# EAGLE design Outline (EAGLE 6.2)
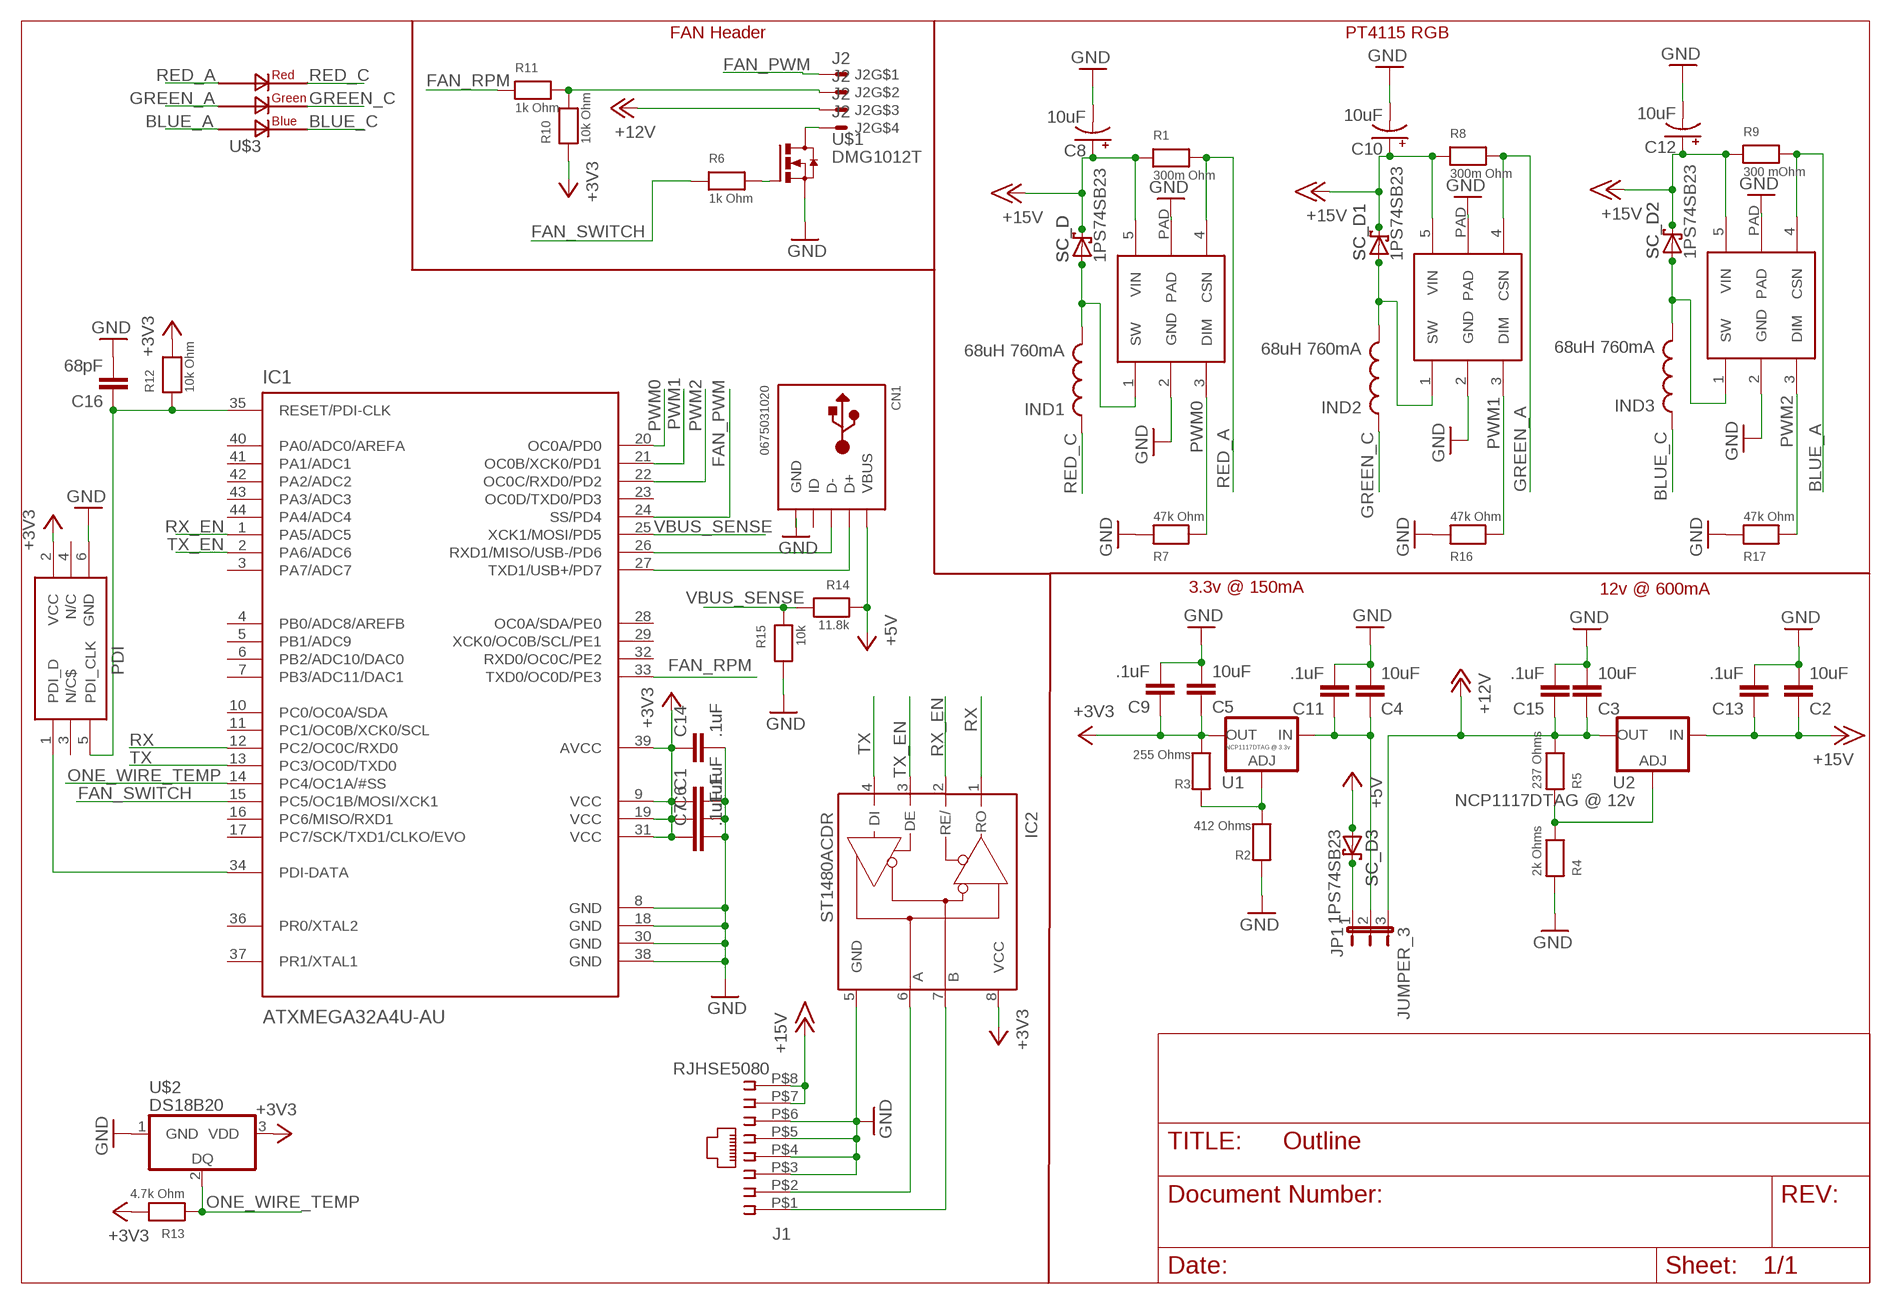
[diagram p0: schematic, sheet 1]

## Parts
C1  .1uF  CAP0603-CAP  [0603-CAP]
C2  10uF  CAP1210  [1210]
C3  10uF  CAP1210  [1210]
C4  10uF  CAP1210  [1210]
C5  10uF  CAP1210  [1210]
C6  .1uF  CAP0603-CAP  [0603-CAP]
C7  .1uF  CAP0603-CAP  [0603-CAP]
C8  10uF  CAP_POLC  [PANASONIC_C]
C9  .1uF  CAP0603-CAP  [0603-CAP]
C10  10uF  CAP_POLC  [PANASONIC_C]
C11  .1uF  CAP0603-CAP  [0603-CAP]
C12  10uF  CAP_POLC  [PANASONIC_C]
C13  .1uF  CAP0603-CAP  [0603-CAP]
C14  .1uF  CAP0603-CAP  [0603-CAP]
C15  .1uF  CAP0603-CAP  [0603-CAP]
C16  68pF  CAP0603-CAP  [0603-CAP]
CN1  0675031020  USB_MINI_B  [MOLEX_675031020]
DRV0  PT4115  [SOT89-5]
DRV1  PT4115  [SOT89-5]
DRV2  PT4115  [SOT89-5]
IC1  ATXMEGA32A4U-AU  ATXMEGAXXA4U-AU  [TQFP-44]
IC2  ST1480ACDR  MAX3468CSA  [SO08]
IND1  68uH 760mA  INDUCTOR  [CR54]
IND2  68uH 760mA  INDUCTOR  [CR54]
IND3  68uH 760mA  INDUCTOR  [CR54]
J1  RJHSE5080  AMP_RJ45  [RJHSE5080]
J2  J2  470531000  [47053-1000]
JP1  JUMPER_3  [JP2E]
PDI  AVR_PDI  [AVR_PDI]
R1  300m Ohm  RESISTOR0805  [0805]
R2  412 Ohms  RESISTOR0603  [0603]
R3  255 Ohms  RESISTOR0603  [0603]
R4  2k Ohms  RESISTOR0603  [0603]
R5  237 Ohms  RESISTOR0603  [0603]
R6  1k Ohm  RESISTOR0603  [0603]
R7  47k Ohm  RESISTOR0603  [0603]
R8  300m Ohm  RESISTOR0805  [0805]
R9  300 mOhm  RESISTOR0805  [0805]
R10  10k Ohm  RESISTOR0603  [0603]
R11  1k Ohm  RESISTOR0603  [0603]
R12  10k Ohm  RESISTOR0603  [0603]
R13  4.7k Ohm  RESISTOR0603  [0603]
R14  11.8k  RESISTOR0603  [0603]
R15  10k  RESISTOR0603  [0603]
R16  47k Ohm  RESISTOR0603  [0603]
R17  47k Ohm  RESISTOR0603  [0603]
SC_D  1PS74SB23  SCHOTTYKY  [SOT-457]
SC_D1  1PS74SB23  SCHOTTYKY  [SOT-457]
SC_D2  1PS74SB23  SCHOTTYKY  [SOT-457]
SC_D3  1PS74SB23  SCHOTTKY_2  [NSR05F20]
U1  NCP1117DTAG @ 3.3v  V_REG_317DPACK  [V-REG_DPACK]
U2  NCP1117DTAG @ 12v  V_REG_317DPACK  [V-REG_DPACK]
U$1  DMG1012T  [DMG1012T]
U$2  DS18B20  [TOP-92-INLINE]
U$3  10W_RGB_LED  [10W_LED]

## Nets
+3V3: C1.1 C5.1 C6.1 C7.1 C9.1 C14.1 IC1.9(VCC) IC1.19(VCC) IC1.31(VCC) IC1.39(AVCC) IC2.8(VCC) PDI.2(VCC) R3.2 R10.1 R12.2 R13.2 U1.4(OUT) U$2.3(VDD)
+5V: CN1.P$1(VBUS) R14.1 SC_D3.P$2(A)
+12V: C3.1 C15.1 J2.3 JP1.3 R5.2 U2.4(OUT)
+15V: C2.1 C8.+ C10.+ C12.+ C13.1 DRV0.5(VIN) DRV1.5(VIN) DRV2.5(VIN) J1.P$7 J1.P$8 R1.1 R8.1 R9.1 SC_D1.P$2(C) SC_D1.P$5(C) SC_D2.P$2(C) SC_D2.P$5(C) SC_D.P$2(C) SC_D.P$5(C) U2.3(IN)
BLUE_A: DRV2.4(CSN) R9.2 U$3.B$A
BLUE_C: IND3.P$1 U$3.B$C
FAN_PWM: IC1.24(SS/PD4) J2.1
FAN_RPM: IC1.33(TXD0/OC0D/PE3) R11.1
FAN_SWITCH: IC1.15(PC5/OC1B/MOSI/XCK1) R6.1
GND: C1.2 C2.2 C3.2 C4.2 C5.2 C6.2 C7.2 C8.- C9.2 C10.- C11.2 C12.- C13.2 C14.2 C15.2 C16.2 CN1.P$5(GND) DRV0.2(GND) DRV0.PAD DRV1.2(GND) DRV1.PAD DRV2.2(GND) DRV2.PAD IC1.8(GND) IC1.18(GND) IC1.30(GND) IC1.38(GND) IC2.5(GND) J1.P$3 J1.P$4 J1.P$5 J1.P$6 PDI.6(GND) R2.1 R4.1 R7.1 R15.2 R16.1 R17.1 U$1.P$S(S) U$2.1(GND)
GREEN_A: DRV1.4(CSN) R8.2 U$3.G$A
GREEN_C: IND2.P$1 U$3.G$C
N$1: R2.2 R3.1 U1.1(ADJ)
N$2: R4.2 R5.1 U2.1(ADJ)
N$3: J2.4 U$1.P$D(D)
N$4: R6.2 U$1.P$G(G)
N$6: JP1.1 SC_D3.P$1(C)
N$9: DRV0.1(SW) IND1.P$2 SC_D.P$1(A) SC_D.P$3(A) SC_D.P$4(A) SC_D.P$6(A)
N$12: DRV1.1(SW) IND2.P$2 SC_D1.P$1(A) SC_D1.P$3(A) SC_D1.P$4(A) SC_D1.P$6(A)
N$15: DRV2.1(SW) IND3.P$2 SC_D2.P$1(A) SC_D2.P$3(A) SC_D2.P$4(A) SC_D2.P$6(A)
N$20: IC1.34(PDI-DATA) PDI.1(PDI_D)
N$21: C4.1 C11.1 JP1.2 U1.3(IN)
N$22: C16.1 IC1.35(RESET/PDI-CLK) PDI.5(PDI_CLK) R12.1
N$25: J2.2 R10.2 R11.2
ONE_WIRE_TEMP: IC1.14(PC4/OC1A/#SS) R13.1 U$2.2(DQ)
PWM0: DRV0.3(DIM) IC1.20(OC0A/PD0) R7.2
PWM1: DRV1.3(DIM) IC1.21(OC0B/XCK0/PD1) R16.2
PWM2: DRV2.3(DIM) IC1.22(OC0C/RXD0/PD2) R17.2
RED_A: DRV0.4(CSN) R1.2 U$3.R$A
RED_C: IND1.P$1 U$3.R$C
RS485_N: IC2.7(B) J1.P$1
RS485_P: IC2.6(A) J1.P$2
RX: IC1.12(PC2/OC0C/RXD0) IC2.1(RO)
RX_EN: IC1.1(PA5/ADC5) IC2.2(RE/)
TX: IC1.13(PC3/OC0D/TXD0) IC2.4(DI)
TX_EN: IC1.2(PA6/ADC6) IC2.3(DE)
USB+: CN1.P$3(D+) IC1.27(TXD1/USB+/PD7)
USB-: CN1.P$2(D-) IC1.26(RXD1/MISO/USB-/PD6)
VBUS_SENSE: IC1.25(XCK1/MOSI/PD5) R14.2 R15.1
Unconnected: CN1.P$4(ID) IC1.3(PA7/ADC7) IC1.4(PB0/ADC8/AREFB) IC1.5(PB1/ADC9) IC1.6(PB2/ADC10/DAC0) IC1.7(PB3/ADC11/DAC1) IC1.10(PC0/OC0A/SDA) IC1.11(PC1/OC0B/XCK0/SCL) IC1.16(PC6/MISO/RXD1) IC1.17(PC7/SCK/TXD1/CLKO/EVO) IC1.23(OC0D/TXD0/PD3) IC1.28(OC0A/SDA/PE0) IC1.29(XCK0/OC0B/SCL/PE1) IC1.32(RXD0/OC0C/PE2) IC1.36(PR0/XTAL2) IC1.37(PR1/XTAL1) IC1.40(PA0/ADC0/AREFA) IC1.41(PA1/ADC1) IC1.42(PA2/ADC2) IC1.43(PA3/ADC3) IC1.44(PA4/ADC4) PDI.3(N/C$) PDI.4(N/C)

## Notes on the sheet
- FAN Header | PT4115 RGB
- 3.3v @ 150mA | 12v @ 600mA

## Power pins joined to a net without a drawn wire
GND: CN1.GND@1(GND) CN1.GND@2(GND) CN1.GND@3(GND) CN1.GND@4(GND)

## Library data of the parts
C1-C7 C9 C11 C13-C16 = SparkFun:CAP: Capacitor Standard 0603 ceramic capacitor, and 0.1" leaded capacitor.
C8 C10 C12 = SparkFun:CAP_POL: Capacitor Polarized These are standard SMD and PTH capacitors. Normally 10uF, 47uF, and 100uF in electrolytic and tantalum varieties. Always verify the external diameter of the through hole cap, it varies with capacity, voltage, and manufacturer. The EIA devices should be standard.
CN1 = TechIsCool:USB_MINI_B
DRV0 DRV1 DRV2 = 1dah:PT4115: Small switching mode constant current PS
IC1 = nonolith:ATXMEGAXXA4U: ATXMEGA A4U Series (XMEGA+USB)
IC2 = maxim:MAX34*: +5V, Fail-Safe, 40Mbps, Profibus RS-485/RS-422 Transceivers Source: MAX3465-MAX3469.pdf; MPN: MAX3468CSA+; OC_FARNELL: unknown; OC_NEWARK: 76K6721
IND1-IND3 = TechIsCool:INDUCTOR
J1 = TechIsCool:AMP_RJ45
J2 = TechIsCool:470531000
JP1 = TechIsCool:JUMPER_3
PDI = TechIsCool:AVR_PDI
R1-R17 = nonolith:RESISTOR: Resistors 0402 - 0402 Surface Mount Package 10.0K 1% 1/16W [Digikey: 311-10.0KLRTR-ND] 0603 - 0603 Surface Mount Package 0 Ohm 1/10 Watt 1% Resistor 15 Ohm 1/10 Watt 1% Resistor 33 Ohm 1/10 Watt 1% Resistor 49.9 Ohm 1/10 Watt 1% Resistor 100 Ohm 1/10 Watt 1% Resistor 150 Ohm 1/10 Watt 1% Resistor 240 Ohm 1/10 Watt 1% Resistor 390 Ohm 1/10 Watt 1% Resistor 560 Ohm 1/10 Watt 1% Resistor 750 Ohm 1/10 Watt 1% Resistor 1.0K Ohm 1/10 Watt 1% Resistor 1.5K Ohm 1/10 Watt 1% Resistor 2.0K Ohm 1/10 Watt 1% Resistor 4.7K Ohm 1/10 Watt 1% Resistor 10.0K Ohm 1/10 Watt 1% Resistor 20.0K Ohm 1/10 Watt 1% Resistor 33.0K Ohm 1/10 Watt 1% Resistor 100.0K Ohm 1/10 Watt 1% Resistor 0805 - 0805 Surface Mount Package 0 Ohm 1/8 Watt 1% Resistor 33 Ohm 1/8 Watt 1% Resistor 100 Ohm 1/8 Watt 1% Resistor 150 Ohm 1/8 Watt 1% Resistor 200 Ohm 1/8 Watt 1% Resistor 240 Ohm 1/8 Watt 1% Resistor 330 Ohm 1/8 Watt 1% Resistor 390 Ohm 1/8 Watt 1% Resistor 470 Ohm 1/8 Watt 1% Resistor 1.0K Ohm 1/8 Watt 1% Resistor 1.5K Ohm 1/8 Watt 1% Resistor 2.0K Ohm 1/8 Watt 1% Resistor 4.7K Ohm 1/8 Watt 1% Resistor 5.1K Ohm 1/8 Watt 1% Resistor 5.6K Ohm 1/8 Watt 1% Resistor 10.0K Ohm 1/8 Watt 1% Resistor 22.0K Ohm 1/8 Watt 1% Resistor 33.0K Ohm 1/8 Watt 1% Resistor 100K Ohm 1/8 Watt 1% Resistor 1206 - 1206 Surface Mount Package
SC_D SC_D1 SC_D2 = TechIsCool:SCHOTTYKY
SC_D3 = TechIsCool:SCHOTTKY_2
U1 U2 = SparkFun:V_REG_317: Voltage Regulator Standard LM317 adjustable voltage regulator. AOI (Adjust Output Input). Google 'LM317 Calculator' for easy to use app to get the two resistor values needed. 240/720 for 5V output. 240/390 for 3.3V output. Spark Fun Electronics SKU : COM-00527
U$1 = TechIsCool:DMG1012T
U$2 = TechIsCool:DS18B20
U$3 = TechIsCool:10W_RGB_LED

## Board
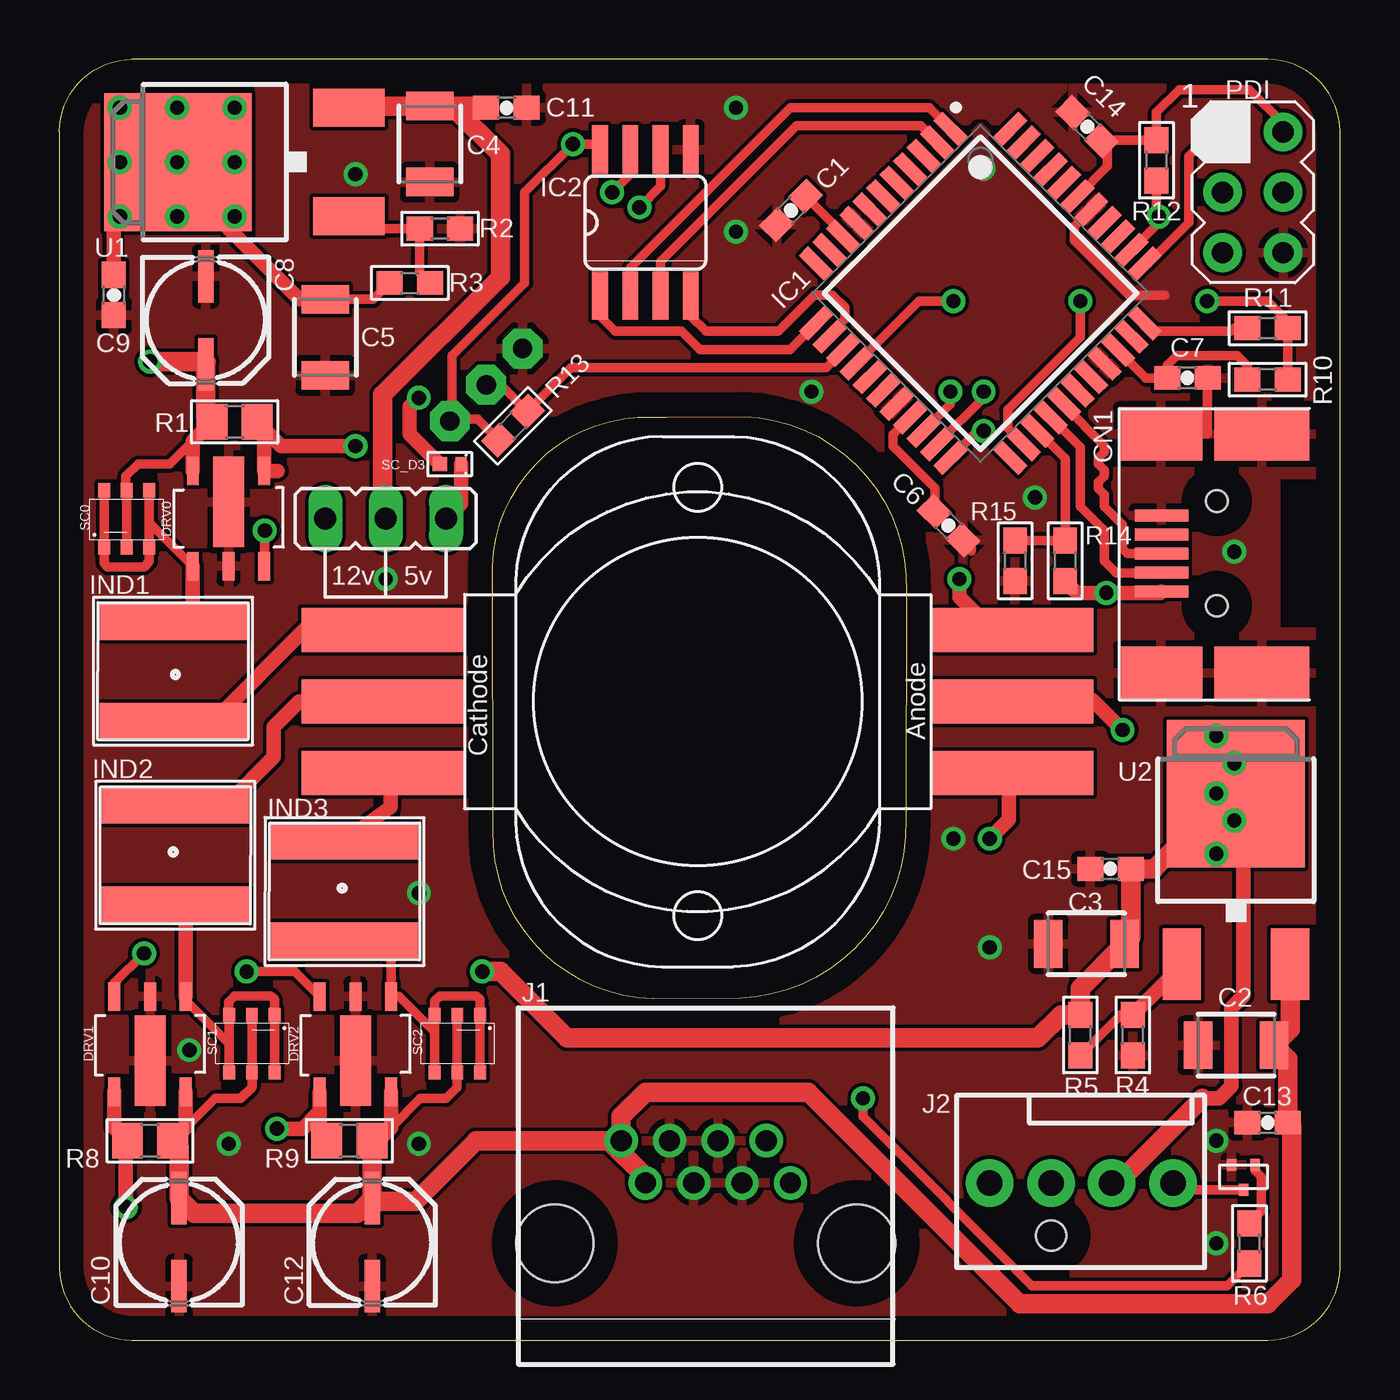
[diagram p1: board, top side]
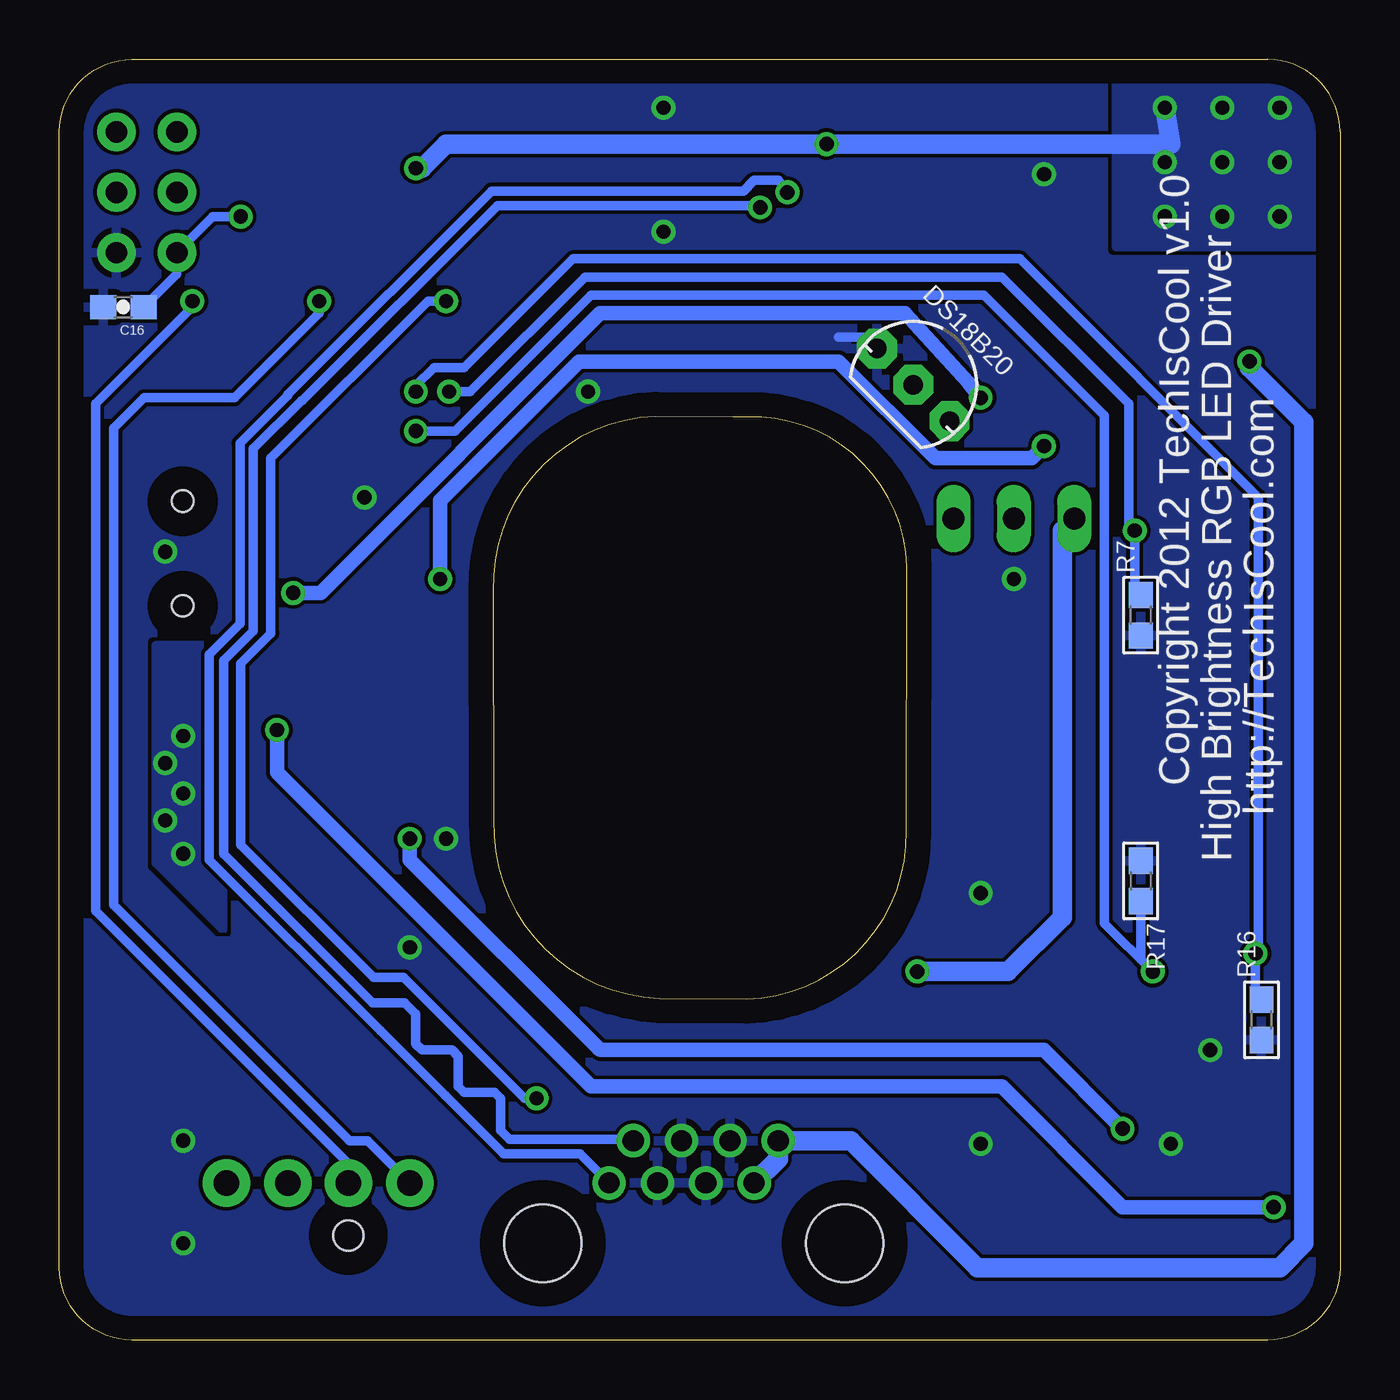
[diagram p2: board, bottom side, seen from below]

Size 53.85 x 53.85 mm. Coordinates in mm from the lower left corner, seen from the top.
Outline: 50.8,0 3.05,0 arc-90 0,3.05 0,50.8 arc-90 3.05,53.85 50.8,53.85 arc-90 53.85,50.8 53.85,3.05
Outline: 50.8,0 arc90 53.85,3.05
Outline: 50.8,0 arc90 53.85,3.05
Copper layers (1*16): Top 0.035mm / dielectric 1.6mm / Bottom 0.035mm
Design rules: minimum track width 6mil, minimum drill 0.3mm, track to track 6mil, track to pad 8mil, pad to pad 8mil, via to via 8mil, smd to smd 8mil, copper to edge 40mil, drill to drill 8mil, minimum pad ring 10mil, minimum via ring 8mil, stop-mask expansion 4mil, vias tented up to drill 0mil, thermal gap 10mil

### Footprints (pad centres in the part's own frame; a part is rotated, then mirrored left to right if it is on the bottom)
0603-CAP = smd 1.1 x 1: 1 -0.85,0; 2 0.85,0
1210 = smd 1.2 x 2: 1 -1.6,0; 2 1.6,0
PANASONIC_C = smd 2.2 x 0.65: + 1.9,-0.2; - -1.8,-0.2
MOLEX_675031020 = smd 4 x 2.25: GND@1 2,4.925; GND@4 2,-5.125 | smd 3.5 x 2.25: GND@2 -2.25,4.925; GND@3 -2.25,-5.125 | smd 2.25 x 0.5: P$1 -2.225,-1.7; P$2 -2.225,-0.9; P$3 -2.225,-0.1; P$4 -2.225,0.7; P$5 -2.225,1.5 | hole 0.9: 0.1,2.1; 0.1,-2.3
SOT89-5 = smd 0.5 x 1.2: 1 -1.5,-2; 2 0,-2; 3 1.5,-2; 4 1.5,2; 5 -1.5,2 | smd 1.3 x 3.8: PAD 0,0.7
TQFP-44 = smd 1.55 x 0.55: 1 -5.75,4; 2 -5.75,3.2; 3 -5.75,2.4; 4 -5.75,1.6; 5 -5.75,0.8; 6 -5.75,0; 7 -5.75,-0.8; 8 -5.75,-1.6; 9 -5.75,-2.4; 10 -5.75,-3.2; 11 -5.75,-4; 23 5.75,-4; 24 5.75,-3.2; 25 5.75,-2.4; 26 5.75,-1.6; 27 5.75,-0.8; 28 5.75,0; 29 5.75,0.8; 30 5.75,1.6; 31 5.75,2.4; 32 5.75,3.2; 33 5.75,4 | smd 0.55 x 1.55: 12 -4,-5.75; 13 -3.2,-5.75; 14 -2.4,-5.75; 15 -1.6,-5.75; 16 -0.8,-5.75; 17 0,-5.75; 18 0.8,-5.75; 19 1.6,-5.75; 20 2.4,-5.75; 21 3.2,-5.75; 22 4,-5.75; 34 4,5.75; 35 3.2,5.75; 36 2.4,5.75; 37 1.6,5.75; 38 0.8,5.75; 39 0,5.75; 40 -0.8,5.75; 41 -1.6,5.75; 42 -2.4,5.75; 43 -3.2,5.75; 44 -4,5.75
SO08 = smd 0.66 x 2.032: 1 -1.905,-3.073; 2 -0.635,-3.073; 3 0.635,-3.073; 4 1.905,-3.073; 5 1.905,3.073; 6 0.635,3.073; 7 -0.635,3.073; 8 -1.905,3.073
CR54 = smd 6.2 x 1.55: P$1 3.09,4.975; P$2 3.1,0.775
RJHSE5080 = drill 0.889: P$1 11.43,7.62; P$2 10.414,9.398; P$3 9.398,7.62; P$4 8.382,9.398; P$5 7.366,7.62; P$6 6.35,9.398; P$7 5.334,7.62; P$8 4.318,9.398 | hole 3.251: 14.224,5.08; 1.524,5.08
47053-1000 = drill 1.07 pad 2: 1 0,0; 2 2.58,0; 3 5.13,0; 4 7.72,0 | hole 1.27: 2.58,-2.21
JP2E = drill 0.914 long: 1 -2.54,0; 2 0,0; 3 2.54,0
AVR_PDI = drill 0.9 pad 1.626: 1 -1.27,2.54; 2 1.27,2.54; 3 -1.27,0; 4 1.27,0; 5 -1.27,-2.54; 6 1.27,-2.54
0805 = smd 1.3 x 1.5: 1 -0.95,0; 2 0.95,0
0603 = smd 1.1 x 1: 1 -0.85,0; 2 0.85,0
SOT-457 = smd 0.5 x 0.6: P$1 0.1,0.3; P$2 1.05,0.3; P$3 2,0.3; P$4 2,2.71; P$5 1.05,2.71; P$6 0.1,2.71
NSR05F20 = smd 0.47 x 0.6: P$1 0,0 | smd 0.6 x 0.6: P$2 0.9,0
V-REG_DPACK = smd 1.6 x 3: 1 -2.28,-4.8; 3 2.28,-4.8 | smd 5.8 x 6.2: 4 0,2.38
DMG1012T = smd 0.4 x 0.51: P$D 0,1.045; P$G -0.5,0; P$S 0.5,0
TOP-92-INLINE = drill 0.813 pad 1.676 octagon: 1 -2.159,0; 2 0,0; 3 2.159,0
10W_LED = smd 6.792 x 1.85: B$A 13.062,-2.719; B$C -13.446,-2.719; G$A 13.062,0.281; G$C -13.446,0.281; R$A 13.062,3.281; R$C -13.446,3.281

### Placement (x,y rotation side)
C1  30.77,47.5 225 top
C2  49.48,12.4 180 top
C3  43.18,16.66 180 top
C4  15.57,50.29 270 top
C5  11.18,42.16 270 top
C6  37.39,34.24 315 top
C7  47.43,40.46 0 top
C8  6.35,42.93 270 top
C9  2.29,43.94 270 top
C10  4.83,4.06 90 top
C11  18.8,51.82 0 top
C12  12.95,4.06 90 top
C13  50.8,9.14 180 top
C14  43.21,51.02 135 top
C15  44.2,19.81 180 top
C16  51.16,43.43 180 bottom
CN1  48.56,33.17 0 top
DRV0  7.11,34.54 0 top
DRV1  3.81,12.45 180 top
DRV2  12.45,12.45 180 top
IC1  38.73,44.02 315 top
IC2  24.64,46.99 0 top
IND1  7.87,30.99 180 top
IND2  1.78,17.53 0 top
IND3  8.89,16 0 top
J1  19.3,-1.02 0 top
J2  39.12,6.6 0 top
JP1  13.72,34.54 180 top
PDI  50.18,48.26 0 top
R1  7.37,38.61 0 top
R2  16,46.74 180 top
R3  14.73,44.45 180 top
R4  45.14,12.83 90 top
R5  42.93,12.83 90 top
R6  50.04,4.06 90 top
R7  8.38,30.48 90 bottom
R8  3.81,8.38 180 top
R9  12.19,8.38 180 top
R10  50.8,40.39 0 top
R11  50.8,42.55 0 top
R12  46.13,49.61 90 top
R13  19.07,38.44 225 top
R14  42.29,32.77 90 top
R15  40.18,32.77 270 top
R16  3.3,13.46 90 bottom
R17  8.38,19.3 270 bottom
SC_D  1.78,33.02 0 top
SC_D1  9.14,13.97 180 top
SC_D2  17.78,13.97 180 top
SC_D3  16.89,36.83 180 top
U1  7.37,49.53 90 top
U2  49.47,20.6 0 top
U$1  49.78,7.37 180 top
U$2  17.94,40.17 315 bottom
U$3  27.03,26.57 0 top

### Tracks (layer width: path | path; a pad name or v marks a point on that pad's centre or on a via)
+3V3  (via drill 0.6, 0.6 pad 0.81)
  Top 0.406: PDI.2 51.45,51.16 50.04,52.58 47.09,52.58 46.13,51.62 R12.2 44.1,50.46 44.07,50.42 | C1.1 32.97,46.51 IC1.9 | IC1.39 44.07,49.36 44.07,50.42 | IC1.19 35.05,38.08 35.05,37.59 36.81,35.83 C6.1 | IC1.31 45.68,40.46 C7.1 46.58,40.99 46.99,41.4 49.53,41.4 49.95,40.98 R10.1 | 16.51,38.73 U$2.3 | IC2.8 22.5,50.29 v21.59,50.29 19.56,48.26 19.56,44.45 16.51,41.4 16.51,38.73 | 16.51,38.73 17.57,38.73 R13.2 | v4.95,47.24 4.83,49.44 U1.4 | C5.1 13.2,43.76 R3.2 | 44.07,50.42 C14.1
  Top 0.61: C5.1 10.08,43.76 7.11,46.74 v7.37,47.24 | v38.86,49.28 38.86,49.02 | C9.1 2.29,47.08 | U1.4 4.73,49.12
  Top 0.813: 2.29,47.08 v2.54,47.24
  Bottom 0.813: v7.37,51.82 7.11,50.29 v21.59,50.29 37.59,50.29 38.61,49.28 v38.86,49.28
  other vias: 4.95,51.82 2.54,51.82 2.54,49.53 4.95,49.53 7.37,49.53
  pour Top: 31.67,43.99 38.73,36.96 45.8,44.02 38.73,51.08 31.65,43.99
  pour Bottom: 0,53.85 9.4,53.85 9.4,45.97 0,45.97
+5V  (via drill 0.6)
  Top 0.61: CN1.P$1 46.29,31.42 v44.02,31.42 42.79,31.42 R14.1 | SC_D3.P$2 15.99,36.84 14.73,38.1 14.73,39.24 v15.11,39.62
  Bottom 0.61: v44.02,31.42 42.88,31.42 31.11,43.18 18.29,43.18 15.62,40.26 v15.11,39.62
+12V  (via drill 0.6)
  Top 0.406: 46.99,20.5 48.04,21.55 U2.4 | U2.4 49.47,20.64 49.78,20.32 | 42.92,14.03 42.92,13.69 R5.2 | U2.4 v48.65,22.98 v48.64,22.99
  Top 0.61: 48.06,10.16 48.77,10.16 49.28,10.67 49.28,13.97 49.78,14.48 49.78,20.32 49.78,20.83
  Top 0.813: v17.78,15.49 18.54,15.49 21.34,12.7 41.15,12.7 42.12,13.68 R5.2 42.89,13.72 | 48.06,10.16 44.5,6.6 J2.3 | 42.92,14.03 42.92,14.79 C3.1 45.05,16.92 C15.1 46.01,19.81 47.75,21.55 | 47.3,21.55 47.75,21.55 | 47.75,21.55 48.04,21.55
  Bottom 0.813: v17.78,15.49 13.97,15.49 11.68,17.78 11.68,34.04 JP1.3
  other vias: 49.4,21.84 49.4,24.26 48.64,25.4 48.64,20.45
  pour Bottom: 49.78,29.21 46.99,29.21 46.99,17.27 49.78,20.07
+15V  (via drill 0.6 pad 0.81)
  Top 0.406: SC_D.P$2 SC_D.P$5 2.79,35.76 2.79,36.32 3.3,36.83 4.64,36.83 5.61,37.8 | SC_D1.P$2 SC_D1.P$5 8.09,10.63 7.62,10.16 6.54,10.16 5.31,8.93 | SC_D2.P$2 SC_D2.P$5 16.73,10.63 16.26,10.16 15.17,10.16 13.95,8.93
  Top 0.61: DRV0.5 5.61,37.8 R1.1 6.15,38.87 | DRV1.5 5.31,8.93 R8.1 arc-90 5.03,8.12 | 13.15,8.37 R9.1 13.4,8.38 13.95,8.93 DRV2.5 | 6.27,41.15 C8.+ 6.03,41.15 | C12.+ 13.28,5.84
  Top 0.813: 5.03,8.12 C10.+ 5.66,5.33 12.52,5.33 C12.+ 13.15,8.37 | 6.15,38.87 C8.+ | v3.81,41.15 6.03,41.15 | U2.3 51.75,13.07 C2.1 51.65,11.83 C13.1 51.82,8.98 51.82,2.54 50.8,1.52 40.39,1.52 31.5,10.41 24.64,10.41 23.62,9.4 J1.P$8 | 13.28,5.84 14.99,5.84 17.53,8.38 23.11,8.38 24.64,6.86 J1.P$7
  Bottom 0.813: J1.P$7 23.62,7.62 J1.P$8 20.57,8.38 15.24,3.05 2.54,3.05 1.52,4.06 1.52,38.61 3.81,40.89 v3.81,41.15
BLUE_A  (via drill 0.6 pad 0.81)
  Top 0.61: R9.2 arc-90 10.95,8.68 10.95,9.62 | 10.95,9.62 DRV2.4 | 10.95,9.62 10.22,8.89 v9.14,8.89 | U$3.B$A 39.92,23.81 39.92,23.37 39.92,22.91 39.92,21.89 v39.12,21.08
  Bottom 0.61: v9.14,8.89 12.45,12.19 31.01,12.19 arc45 31.19,12.27 39.12,20.19 39.12,20.32 arc45 39.12,20.43 v39.12,21.08
BLUE_C
  Top 0.61: IND3.P$1 13.92,22.41 13.92,23.95 U$3.B$C
FAN_PWM  (via drill 0.6 pad 0.81)
  Top 0.406: IC1.24 39.88,38.34 39.88,39.12 42.93,42.16 v42.93,43.69
  Bottom 0.406: v42.93,43.69 42.93,43.18 46.48,39.62 50.29,39.62 51.56,38.35 51.56,18.29 41.66,8.38 40.89,8.38 J2.1
FAN_RPM
  Top 0.406: R11.1 49.4,42.55 49.28,42.42 45.98,42.42 IC1.33
FAN_SWITCH  (via drill 0.6)
  Top 0.406: R6.1 49.11,2.29 40.89,2.29 33.78,9.4 v33.78,10.16 | IC1.15 36.14,43.69 v37.59,43.69
  Bottom 0.406: v33.78,10.16 34.29,10.16 39.37,15.24 40.64,15.24 46.23,20.83 46.23,28.45 44.96,29.72 44.96,37.08 38.35,43.69 v37.59,43.69
GND  (via drill 0.6, 0.6 pad 0.81)
  Top 0.406: IC1.38 42.67,46.83 42.67,46.23 44.96,43.94 46.48,43.94 | C7.2 48.26,40.43 48.26,38.1 CN1.GND@2 | 38.35,33.19 38.35,33.27 | U$2.1 19.81,42.04
  Bottom 0.406: U$2.1 19.94,42.16 21.08,42.16
  other vias: 28.45,46.61 15.11,18.8 28.45,51.82 15.11,8.26 7.11,8.26 31.62,39.88 49.4,33.15 39.12,16.51 37.59,21.08 13.72,32 12.45,49.02 5.46,12.19 48.64,8.38 48.64,4.06 41.02,35.43
  pour Bottom (rank 3): 0,0 53.82,0 53.82,53.82 0,53.82
  pour Top (rank 3): 0,0 53.82,0 53.82,53.8 0,53.8
GREEN_A  (via drill 0.6 pad 0.81)
  Top 0.61: DRV1.4 2.31,8.93 R8.2 2.79,8.32 v2.79,5.59 | v44.7,25.65 43.43,26.92 39.81,26.92 U$3.G$A
  Bottom 0.61: v44.7,25.65 44.7,23.88 31.5,10.67 14.22,10.67 9.14,5.59 v2.79,5.59
GREEN_C
  Top 0.61: IND2.P$1 4.97,22.61 7.11,22.61 9.02,24.51 9.02,25.78 10.09,26.85 U$3.G$C
N$1
  Top 0.406: U1.1 12.68,46.74 R2.2 15.15,44.88 R3.1
N$2
  Top 0.406: R5.1 44.66,13.7 R4.2
  Top 0.61: U2.1 47.19,15.73 R4.2
N$3
  Top 0.406: 49.76,6.35 U$1.P$D 47.12,6.32 J2.4
N$4
  Top 0.406: R6.2 50.55,5.42 50.55,6.86 50.28,7.12 U$1.P$G
N$6
  Top 0.61: SC_D3.P$1 16.89,35.18 JP1.1
N$9
  Top 0.406: SC_D.P$6 SC_D.P$1 1.88,32.67 2.03,32.51 3.56,32.51 3.78,32.73 SC_D.P$3 3.78,34.38 | SC_D.P$4 3.78,34.38 | 3.78,34.38 DRV0.1
  Top 0.61: DRV0.1 5.61,30.21 IND1.P$2
N$12
  Top 0.406: SC_D1.P$4 7.14,12.45 | SC_D1.P$6 SC_D1.P$1 9.04,14.32 8.89,14.48 7.37,14.48 7.11,14.22 7.11,13.7 SC_D1.P$3 7.14,12.45 | DRV1.1 5.31,14.28 7.14,12.45
  Top 0.61: DRV1.1 5.31,18.3 IND2.P$2
N$15
  Top 0.406: SC_D2.P$6 SC_D2.P$1 | SC_D2.P$4 15.78,12.95 | SC_D2.P$1 17.68,14.07 | SC_D2.P$1 17.68,14.32 17.53,14.48 16,14.48 15.78,14.26 SC_D2.P$3 15.78,12.95 | 15.78,12.95 14.29,14.45 DRV2.1 13.95,16.74 13.97,16.76 12,16.76 IND3.P$2
N$20
  Top 0.406: IC1.34 45.76,45.25 47.5,46.99 47.5,49.78 48.52,50.8 PDI.1
N$21
  Top 0.61: 12.34,51.51 11.96,51.51 U1.3 12.25,51.89
  Top 0.813: 12.25,51.89 C4.1 16.51,51.89 | C11.1 17.87,51.89 16.51,51.89 | 16.51,51.89 18.54,49.86 18.54,44.7 13.59,39.75 13.59,34.67 JP1.2
N$22  (via drill 0.6 pad 0.81)
  Top 0.406: IC1.35 46.23,46.99 v46.23,47.24 46.13,47.34 46.13,47.4 46.13,47.5 R12.1 45.97,48.6
  Bottom 0.406: C16.1 48.91,44.83 PDI.5 47.4,47.24 v46.23,47.24
N$25  (via drill 0.6 pad 0.81)
  Top 0.406: R10.2 | R10.2 R11.2 51.65,42.84 50.8,43.69 v48.26,43.69
  Bottom 0.406: J2.2 41.7,7.41 52.32,18.03 52.32,39.37 48.26,43.43 v48.26,43.69
ONE_WIRE_TEMP
  Top 0.406: IC1.14 32.97,41.6 32.26,40.89 21.52,40.89 R13.1 18.54,40.17 U$2.2
PWM0  (via drill 0.6, 0.6 pad 0.81)
  Top 0.406: DRV0.3 8.64,32.57 v8.64,34.04 | IC1.20 37.47,39.36 v37.47,39.88
  Bottom 0.406: v37.47,39.88 36.58,39.88 31.75,44.7 14.22,44.7 8.89,39.37 8.89,34.29 v8.64,34.04 8.64,31.58 arc-90 R7.2
PWM1  (via drill 0.6, 0.6 pad 0.81)
  Top 0.406: IC1.21 | v3.56,16.26 2.31,15.01 DRV1.3 | IC1.21 38.86,39.62 v38.86,39.88
  Bottom 0.406: v38.86,39.88 38.86,40.13 38.1,40.89 36.83,40.89 32.26,45.47 13.46,45.47 3.43,35.43 3.43,16.38 v3.56,16.26 3.56,14.57 R16.2
PWM2  (via drill 0.6, 0.6 pad 0.81)
  Top 0.406: v7.87,15.49 9.9,15.49 DRV2.3 | IC1.22 38.6,38.23 v38.86,38.23
  Bottom 0.406: v38.86,38.23 37.21,38.23 31.5,43.94 14.99,43.94 9.91,38.86 9.91,17.53 v7.87,15.49 8.38,16 R17.2
RED_A  (via drill 0.6, 0.6 pad 0.81)
  Top 0.61: 8.61,38.31 DRV0.4 9.18,36.54 | 8.61,38.31 R1.2 | 8.61,38.31 9.33,37.59 v12.45,37.59 | v37.85,32 37.85,31.24 39.14,29.95 U$3.R$A
  Bottom 0.61: v37.85,32 37.85,35.31 32,41.15 21.08,41.15 17.02,37.08 12.95,37.08 v12.45,37.59
RED_C
  Top 0.61: IND1.P$1 6.46,26.01 10.41,29.97 13.78,29.97 | U$3.R$C 13.78,29.97 | 13.78,29.97 13.88,29.97
RS485_N  (via drill 0.6)
  Top 0.406: IC2.7 24,49.02 v23.24,48.26
  Bottom 0.406: J1.P$1 31.95,7.82 35.18,7.82 37.64,10.28 40.35,12.99 47.55,20.19 47.55,28.83 46.25,30.12 46.25,37.71 44.25,39.71 44.25,39.75 35.69,48.31 25.09,48.31 24.64,48.77 23.62,48.77 v23.24,48.26
RS485_P  (via drill 0.6)
  Top 0.406: IC2.6 25.27,48.51 v24.38,47.62
  Bottom 0.406: 24.21,47.7 24.38,47.7 | 24.38,47.7 35.43,47.7 43.64,39.5 43.67,39.5 45.7,37.48 45.7,29.82 46.94,28.58 46.94,20.45 40.68,14.19 39.33,14.19 38.86,13.72 38.86,12.45 38.61,12.19 37.34,12.19 37.08,11.94 37.08,10.67 36.83,10.41 35.56,10.41 35.31,10.16 35.31,8.81 34.93,8.43 29.77,8.43 J1.P$2 | v24.38,47.62 24.38,47.7
RX
  Top 0.406: IC1.12 30.71,41.66 26.92,41.66 26.16,42.42 23.37,42.42 22.73,43.05 IC2.1
RX_EN
  Top 0.406: IC1.1 36.58,51.82 30.73,51.82 24,45.09 IC2.2
TX
  Top 0.406: IC2.4 26.54,43.05 27.18,42.42 30.23,42.42 31.75,43.94 32.51,43.94 33.02,43.43 33.02,42.93 32.4,42.3 IC1.13
TX_EN
  Top 0.406: IC1.2 36.22,51.05 30.99,51.05 25.27,45.34 IC2.3
USB+
  Top 0.406: IC1.27 42.23,39.31 43.94,37.59 43.94,37.34 43.69,37.08 43.69,36.83 43.94,36.58 43.94,36.32 43.69,36.07 43.69,35.81 43.94,35.56 43.94,35.05 44.7,34.29 44.7,33.27 44.91,33.07 CN1.P$3
USB-
  Top 0.406: 41.7,38.82 IC1.26 42.93,37.55 42.93,35.05 43.94,34.04 43.94,32.77 44.45,32.26 46.33,32.26 CN1.P$2
VBUS_SENSE
  Top 0.406: IC1.25 42.29,37.06 R14.2 41.74,33.6 41.73,33.62 R15.1

### Text on the board
tNames: 12v | 5v
bNames: Copyright 2012 TechIsCool v1.0 | High Brightness RGB LED Driver | http://TechIsCool.com